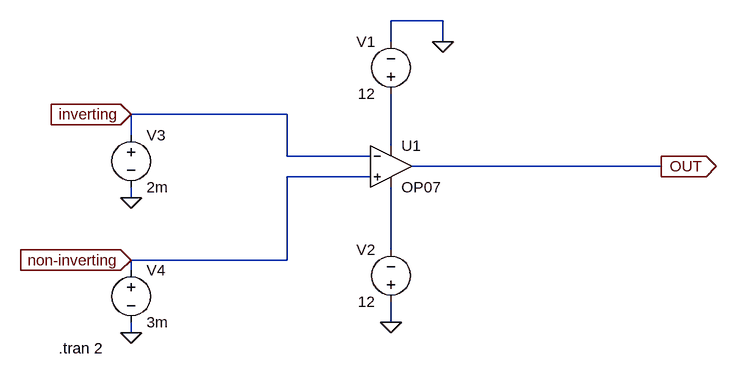
[diagram p0: schematic opAmp_as_basic_comparator.asc]
opAmp_as_basic_comparator.asc, the LTspice schematic file:
Version 4.1
SHEET 1 880 680
WIRE 336 -48 256 -48
WIRE 256 -16 256 -48
WIRE 336 -16 336 -48
WIRE 96 96 -144 96
WIRE -144 128 -144 96
WIRE 256 144 256 64
WIRE 96 160 96 96
WIRE 224 160 96 160
WIRE 672 176 288 176
WIRE 224 192 96 192
WIRE -144 224 -144 208
WIRE 256 304 256 208
WIRE 96 320 96 192
WIRE 96 320 -144 320
WIRE -144 336 -144 320
WIRE 256 416 256 384
WIRE -144 432 -144 416
FLAG 336 -16 0
FLAG 256 416 0
FLAG -144 224 0
FLAG -144 432 0
FLAG 672 176 OUT
IOPIN 672 176 Out
FLAG -144 96 inverting
IOPIN -144 96 In
FLAG -144 320 non-inverting
IOPIN -144 320 In
SYMBOL OpAmps\\OP07 256 112 R0
SYMATTR InstName U1
SYMBOL voltage 256 80 R180
WINDOW 0 24 96 Left 2
WINDOW 3 24 16 Left 2
WINDOW 123 0 0 Left 0
WINDOW 39 0 0 Left 0
SYMATTR InstName V1
SYMATTR Value 12
SYMBOL voltage 256 400 R180
WINDOW 0 24 96 Left 2
WINDOW 3 24 16 Left 2
WINDOW 123 0 0 Left 0
WINDOW 39 0 0 Left 0
SYMATTR InstName V2
SYMATTR Value 12
SYMBOL voltage -144 112 R0
WINDOW 123 0 0 Left 0
WINDOW 39 0 0 Left 0
SYMATTR InstName V3
SYMATTR Value 2m
SYMBOL voltage -144 320 R0
WINDOW 123 0 0 Left 0
WINDOW 39 0 0 Left 0
SYMATTR InstName V4
SYMATTR Value 3m
TEXT -256 456 Left 2 !.tran 2

The netlist it stands for:
* opAmp_as_basic_comparator.asc
X§U1 non-inverting inverting N001 N002 OUT LT1001  ; OP07, pins In+ In- V+ V- OUT
V1 N001 0 12
V2 0 N002 12
V3 inverting 0 2m
V4 non-inverting 0 3m
.tran 2
.lib LTC.lib
.backanno
.end